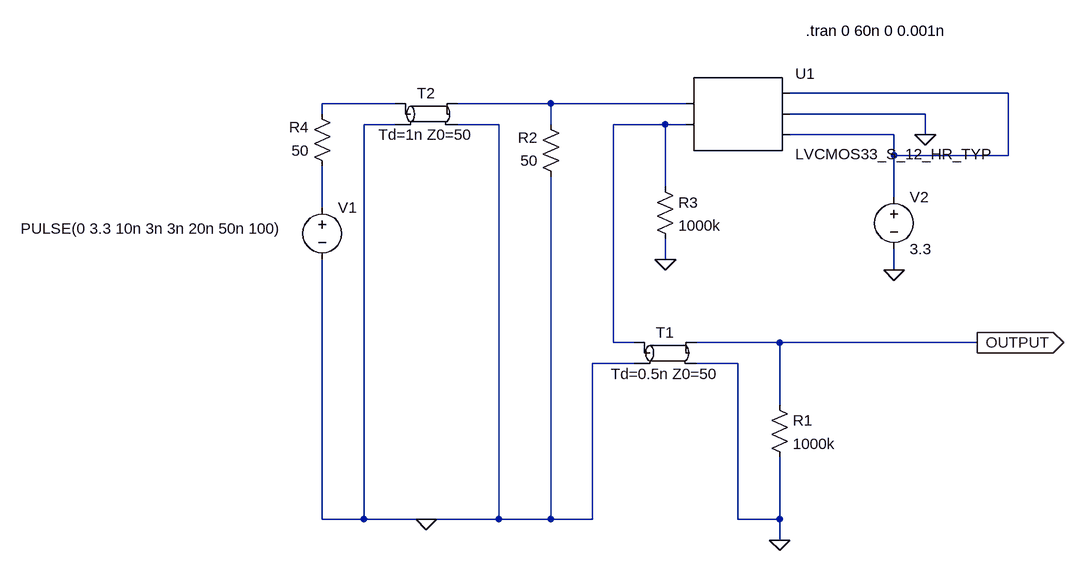
[diagram p0: schematic Draft1.asc]
Draft1.asc, the LTspice schematic file:
Version 4
SHEET 1 880 680
WIRE 624 -112 288 -112
WIRE -320 -96 -432 -96
WIRE -80 -96 -224 -96
WIRE 128 -96 -80 -96
WIRE -432 -80 -432 -96
WIRE 496 -80 288 -80
WIRE -320 -64 -368 -64
WIRE -160 -64 -224 -64
WIRE -80 -64 -80 -96
WIRE 96 -64 16 -64
WIRE 128 -64 96 -64
WIRE 448 -48 288 -48
WIRE 496 -48 496 -80
WIRE 448 -16 448 -48
WIRE 624 -16 624 -112
WIRE 624 -16 448 -16
WIRE 96 32 96 -64
WIRE 448 48 448 -16
WIRE -432 64 -432 0
WIRE 96 144 96 112
WIRE 448 160 448 128
WIRE 16 272 16 -64
WIRE 48 272 16 272
WIRE 272 272 144 272
WIRE 576 272 272 272
WIRE 48 304 -16 304
WIRE 208 304 144 304
WIRE 272 368 272 272
WIRE -432 544 -432 144
WIRE -368 544 -368 -64
WIRE -368 544 -432 544
WIRE -272 544 -368 544
WIRE -160 544 -160 -64
WIRE -160 544 -272 544
WIRE -80 544 -80 16
WIRE -80 544 -160 544
WIRE -16 544 -16 304
WIRE -16 544 -80 544
WIRE 208 544 208 304
WIRE 272 544 272 448
WIRE 272 544 208 544
WIRE 272 576 272 544
FLAG 448 160 0
FLAG 496 -48 0
FLAG 576 272 OUTPUT
IOPIN 576 272 Out
FLAG 272 576 0
FLAG 96 144 0
FLAG -272 544 0
SYMBOL voltage -432 48 R0
WINDOW 3 -464 48 Left 2
WINDOW 123 0 0 Left 0
WINDOW 39 0 0 Left 0
SYMATTR Value PULSE(0 3.3 10n 3n 3n 20n 50n 100)
SYMATTR InstName V1
SYMBOL voltage 448 32 R0
SYMATTR InstName V2
SYMATTR Value 3.3
SYMBOL res -64 32 R180
WINDOW 0 36 76 Left 2
WINDOW 3 36 40 Left 2
SYMATTR InstName R2
SYMATTR Value 50
SYMBOL tline 96 288 R0
SYMATTR InstName T1
SYMATTR Value Td=0.5n Z0=50
SYMBOL res 80 16 R0
SYMATTR InstName R3
SYMATTR Value 1000k
SYMBOL tline -272 -80 R0
SYMATTR InstName T2
SYMATTR Value Td=1n Z0=50
SYMBOL res -416 16 R180
WINDOW 0 36 76 Left 2
WINDOW 3 36 40 Left 2
SYMATTR InstName R4
SYMATTR Value 50
SYMBOL AutoGenerated\\LVCMOS33_S_12_HR_TYP 208 -80 R0
SYMATTR InstName U1
SYMBOL res 256 352 R0
SYMATTR InstName R1
SYMATTR Value 1000k
TEXT 312 -208 Left 2 !.tran 0 60n 0 0.001n

The netlist it stands for:
* Draft1.asc
V1 N005 0 PULSE(0 3.3 10n 3n 3n 20n 50n 100)
V2 N001 0 3.3
R2 0 N003 50
T1 N004 0 OUTPUT 0 Td=0.5n Z0=50
R3 N004 0 1000k
T2 N002 0 N003 0 Td=1n Z0=50
R4 N005 N002 50
* U1: LVCMOS33_S_12_HR_TYP (symbol AutoGenerated\LVCMOS33_S_12_HR_TYP not available, pins judged from their places): pin1=N003 pin2=N004 pin3=N001 pin4=0 pin5=N001
R1 OUTPUT 0 1000k
.tran 0 60n 0 0.001n
.backanno
.end